# EAGLE design countdown (EAGLE 4.16)
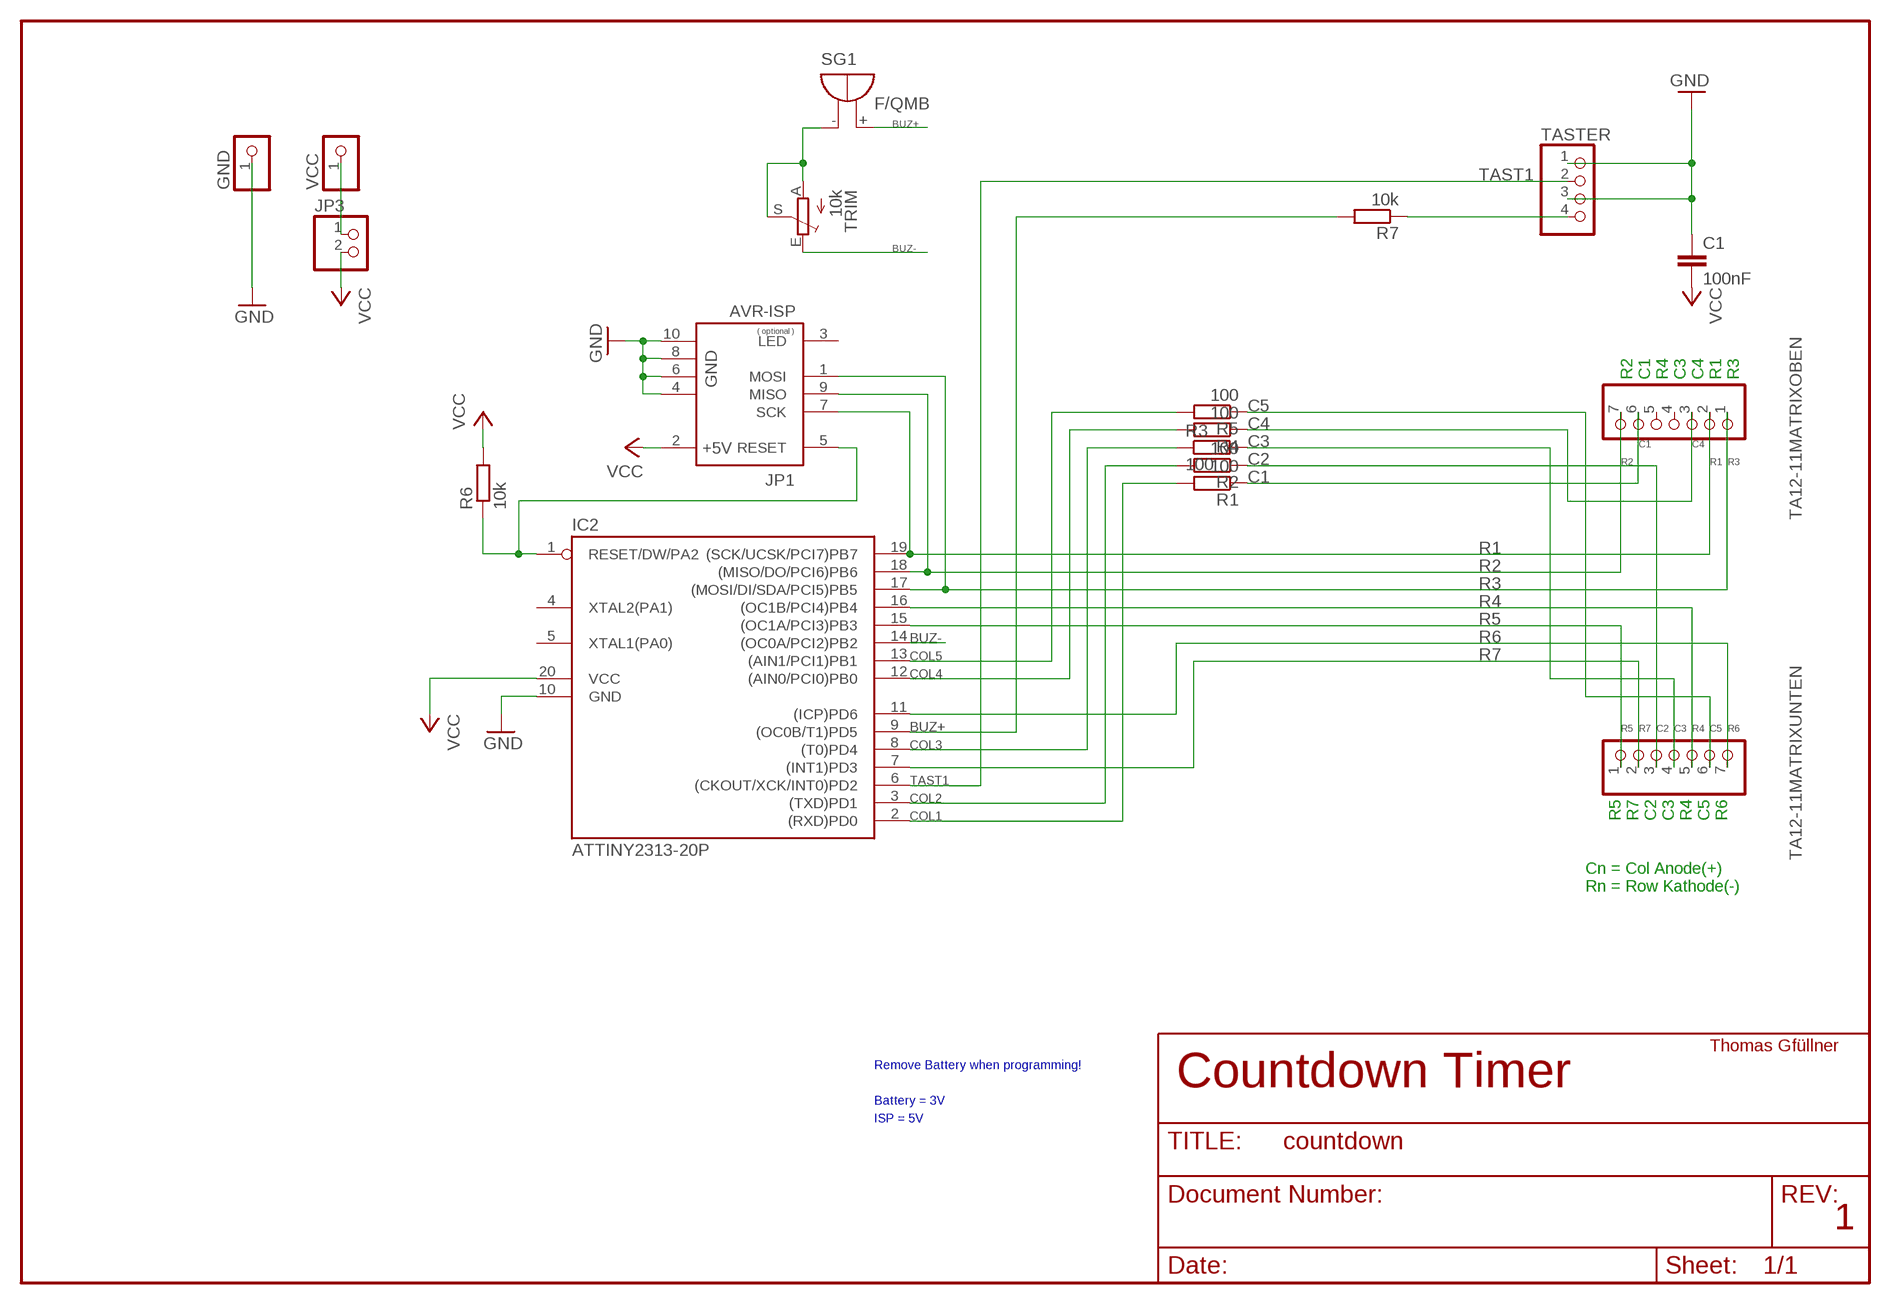
[diagram p0: schematic, sheet 1]

## Parts
C1  100nF  C-EU050-025X075  [C050-025X075]
GND  PINHD-1X1  [1X01]
IC2  ATTINY2313-20P  [DIL20]
JP1  AVR-ISP  [ML10]
JP3  PINHD-1X2  [1X02]
R1  100  R-EU_0207/12  [0207/12]
R2  100  R-EU_0207/12  [0207/12]
R3  100  R-EU_0204/7  [0204/7]
R4  100  R-EU_0207/12  [0207/12]
R5  100  R-EU_0207/12  [0207/12]
R6  10k  R-EU_0204/7  [0204/7]
R7  10k  R-EU_0207/12  [0207/12]
SG1  F/QMB  [F/QMB]
TA12-11MATRIXOBEN  PINHD-1X7  [1X07]
TA12-11MATRIXUNTEN  PINHD-1X7  [1X07]
TASTER  PINHD-1X4  [1X04]
TRIM  10k  TRIM_EU-S75H  [S75H]
VCC  PINHD-1X1  [1X01]

## Nets
BUZ+: IC2.9((OC0B/T1)PD5) R7.2 SG1.+(-)
BUZ-: IC2.14((OC0A/PCI2)PB2) TRIM.E
C1: R1.1 TA12-11MATRIXOBEN.6
C2: R2.1 TA12-11MATRIXUNTEN.3
C3: R3.2 TA12-11MATRIXUNTEN.4
C4: R4.1 TA12-11MATRIXOBEN.3
C5: R5.1 TA12-11MATRIXUNTEN.6
COL1: IC2.2((RXD)PD0) R1.2
COL2: IC2.3((TXD)PD1) R2.2
COL3: IC2.8((T0)PD4) R3.1
COL4: IC2.12((AIN0/PCI0)PB0) R4.2
COL5: IC2.13((AIN1/PCI1)PB1) R5.2
GND: C1.1 GND.1 IC2.10(GND) JP1.4(GND) JP1.6(GND) JP1.8(GND) JP1.10(GND) TASTER.1 TASTER.3
N$7: SG1.-(+) TRIM.A TRIM.S
N$9: IC2.1(RESET/DW/PA2) JP1.5(RESET) R6.1
N$10: R7.1 TASTER.4
N$27: JP3.1 VCC.1
R1: IC2.19((SCK/UCSK/PCI7)PB7) JP1.7(SCK) TA12-11MATRIXOBEN.2
R2: IC2.18((MISO/DO/PCI6)PB6) JP1.9(MISO) TA12-11MATRIXOBEN.7
R3: IC2.17((MOSI/DI/SDA/PCI5)PB5) JP1.1(MOSI) TA12-11MATRIXOBEN.1
R4: IC2.16((OC1B/PCI4)PB4) TA12-11MATRIXUNTEN.5
R5: IC2.15((OC1A/PCI3)PB3) TA12-11MATRIXUNTEN.1
R6: IC2.11((ICP)PD6) TA12-11MATRIXUNTEN.7
R7: IC2.7((INT1)PD3) TA12-11MATRIXUNTEN.2
TAST1: IC2.6((CKOUT/XCK/INT0)PD2) TASTER.2
VCC: C1.2 IC2.20(VCC) JP1.2(+5V) JP3.2 R6.2
Unconnected: IC2.4(XTAL2(PA1)) IC2.5(XTAL1(PA0)) JP1.3(LED) TA12-11MATRIXOBEN.4 TA12-11MATRIXOBEN.5

## Notes on the sheet
- R2 | C1 | R4 | C3 | C4 | R1 | R3
- R5 | R7 | C2 | C3 | R4 | C5 | R6
- Cn = Col Anode(+)
- Rn = Row Kathode(-)
- Thomas Gfüllner
- Remove Battery when programming!
- Countdown Timer
- Battery = 3V
- ISP = 5V
- 1

## Library data of the parts
C1 = rcl:C-EU: CAPACITOR, European symbol
GND VCC = pinhead:PINHD-1X1: PIN HEADER
IC2 = avr:ATTINY2313: MICROCONTROLLER 2 Kbytes FLASH 128 bytes SRAM 128 bytes EEPROM USART USI
JP1 = roboternetz-definitionen:AVR-ISP: ISP ( In System Programming ) Stecker für AVRs Über diesen Anschluß kann ein AVR mit einem Standard ISP-Kabel direkt an einen Parallelport des PC´s angeschlossen und programmiert werden. Die Belegung des ISP-Anschlusses ist zu dem weit verbreitetet STK200 Programmier Dongle kompatibel. Ein entsprechender Dongle ist über zahlreiche Händler lieferbar. Es gibt aber auch viele Selbstbauanleitungen im Internet.
JP3 = pinhead:PINHD-1X2: PIN HEADER
R1-R7 = rcl:R-EU_: RESISTOR, European symbol
SG1 = buzzer:F/QMB: BUZZER Source: Buerklin
TA12-11MATRIXOBEN TA12-11MATRIXUNTEN = pinhead:PINHD-1X7: PIN HEADER
TASTER = pinhead:PINHD-1X4: PIN HEADER
TRIM = pot:TRIM_EU-: POTENTIOMETER

## Board
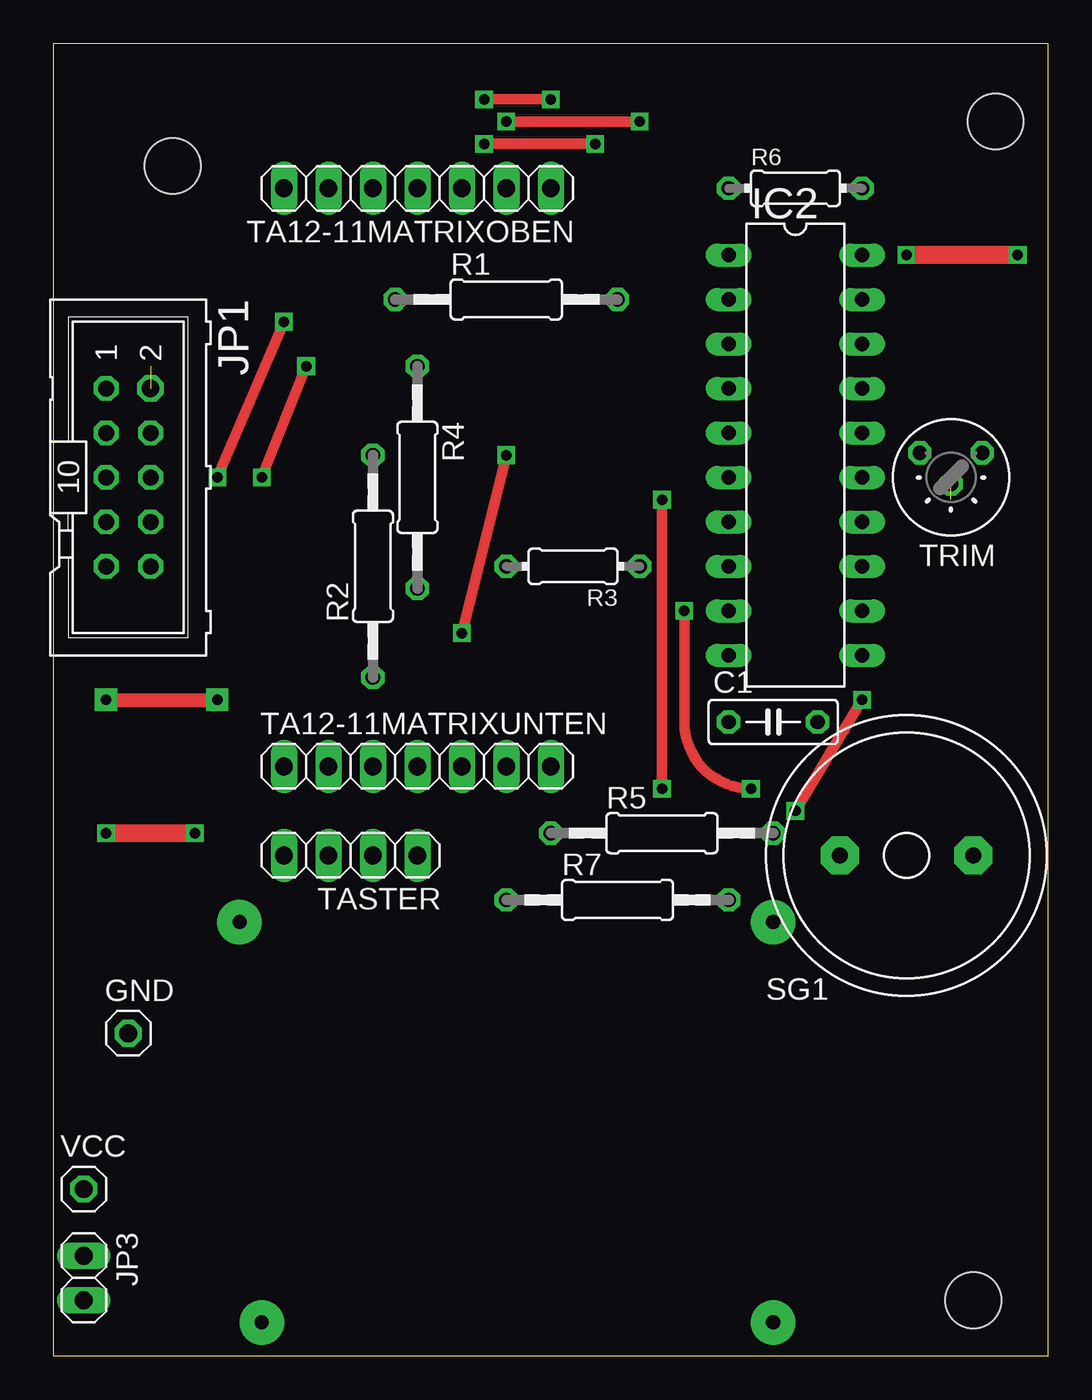
[diagram p1: board, top side]
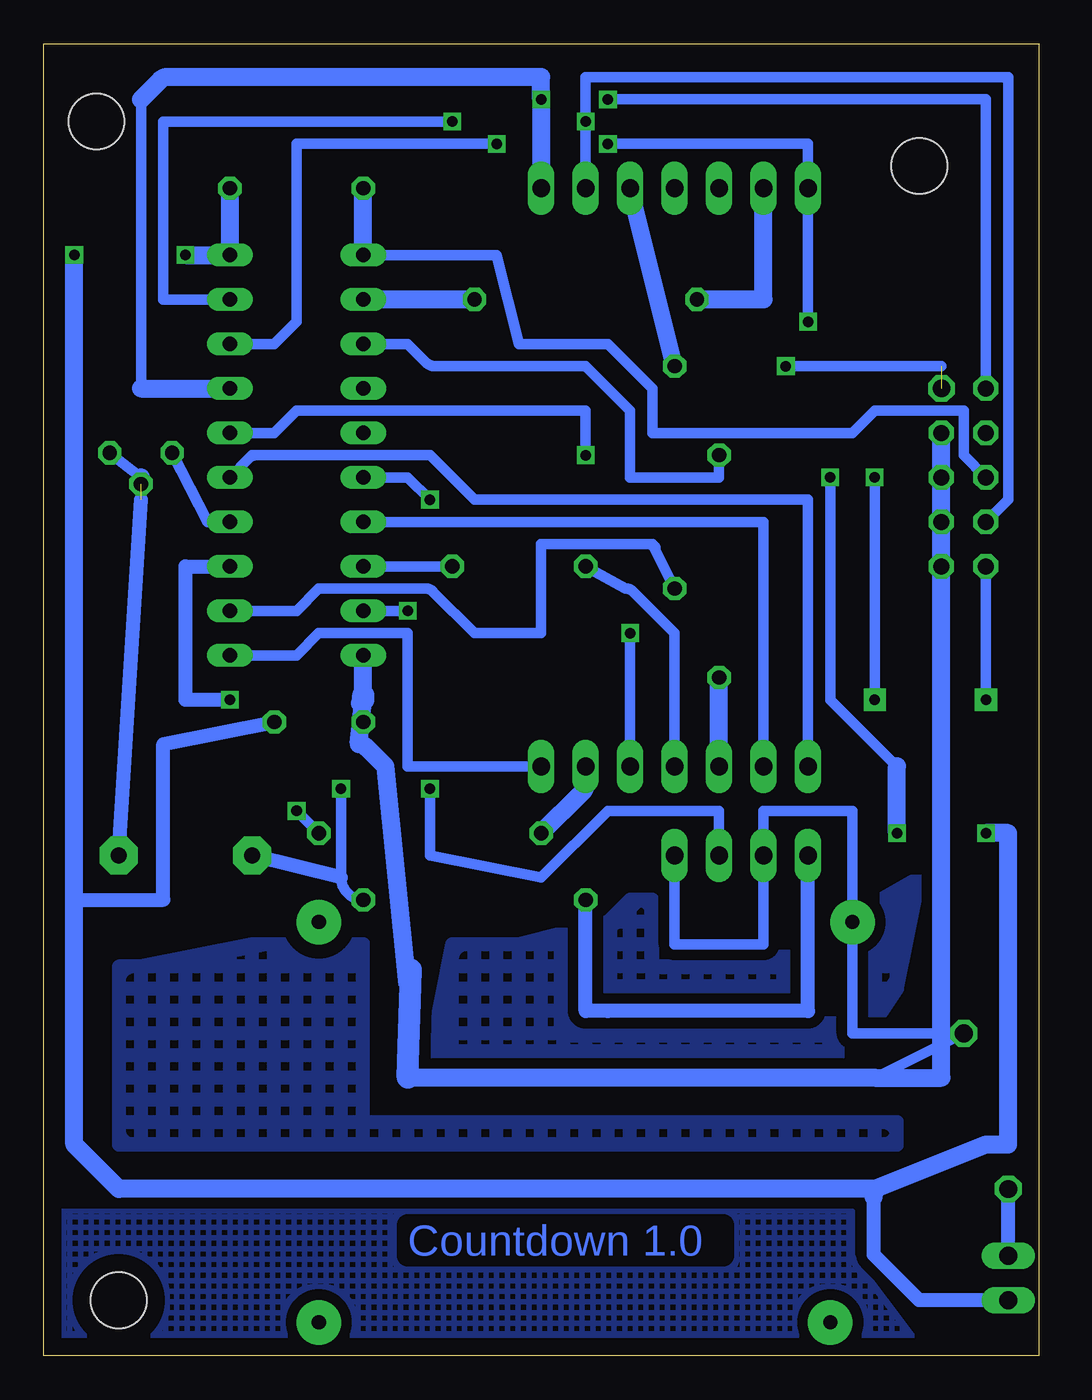
[diagram p2: board, bottom side, seen from below]

Size 56.82 x 74.92 mm. Coordinates in mm from the lower left corner, seen from the top.
Outline: 0,0 56.82,0 56.82,74.92 0,74.92 0,0
Copper layers (1*16): Top 0.035mm / dielectric 1.5mm / Bottom 0.035mm
Design rules "default": minimum track width 10mil, minimum drill 24mil, track to track 8mil, track to pad 8mil, pad to pad 8mil, via to via 8mil, smd to smd 8mil, copper to edge 40mil, drill to drill 8mil, minimum pad ring 10mil, minimum via ring 8mil, stop-mask expansion 4mil, vias tented up to drill 0mil, thermal gap 10mil
Holes 3.2 mm at 52.54,3.17 53.81,70.48 6.82,67.94

### Footprints (pad centres in the part's own frame; a part is rotated, then mirrored left to right if it is on the bottom)
C050-025X075 = drill 0.813 octagon: 1 -2.54,0; 2 2.54,0
1X01 = drill 1.016 octagon: 1 0,0
DIL20 = drill 0.813 long: 1 -11.43,-3.81; 2 -8.89,-3.81; 3 -6.35,-3.81; 4 -3.81,-3.81; 5 -1.27,-3.81; 6 1.27,-3.81; 7 3.81,-3.81; 8 6.35,-3.81; 9 8.89,-3.81; 10 11.43,-3.81; 11 11.43,3.81; 12 8.89,3.81; 13 6.35,3.81; 14 3.81,3.81; 15 1.27,3.81; 16 -1.27,3.81; 17 -3.81,3.81; 18 -6.35,3.81; 19 -8.89,3.81; 20 -11.43,3.81
ML10 = drill 0.914 pad 1.422 octagon: 1 -5.08,-1.27; 3 -2.54,-1.27; 4 -2.54,1.27 | drill 1.016 pad 1.422 octagon: 2 -5.08,1.27 | drill 0.914 octagon: 5 0,-1.27; 6 0,1.27; 7 2.54,-1.27; 8 2.54,1.27; 9 5.08,-1.27; 10 5.08,1.27
1X02 = drill 1.016 long: 1 -1.27,0; 2 1.27,0
0207/12 = drill 0.813 octagon: 1 -6.35,0; 2 6.35,0
0204/7 = drill 0.813 octagon: 1 -3.81,0; 2 3.81,0
F/QMB = drill 0.914 pad 2.159 octagon: + 3.81,0; - -3.81,0
1X07 = drill 1.016 long: 1 -7.62,0; 2 -5.08,0; 3 -2.54,0; 4 0,0; 5 2.54,0; 6 5.08,0; 7 7.62,0
1X04 = drill 1.016 long: 1 -3.81,0; 2 -1.27,0; 3 1.27,0; 4 3.81,0
S75H = drill 0.813 octagon: A -1.778,-1.397; E 1.778,-1.397; S 0,0.381

### Placement (x,y rotation side)
C1  41.11,36.19 0 top
GND  4.28,18.41 0 top
IC2  42.38,51.43 270 top
JP1  4.28,50.16 270 top
JP3  1.74,4.44 270 top
R1  25.87,60.32 0 top
R2  18.25,45.08 90 top
R3  29.68,45.08 180 top
R4  20.79,50.16 270 top
R5  34.76,29.84 0 top
R6  42.38,66.67 0 top
R7  32.22,26.03 0 top
SG1  48.73,28.57 180 top
TA12-11MATRIXOBEN  20.79,66.67 180 top
TA12-11MATRIXUNTEN  20.79,33.65 0 top
TASTER  16.98,28.57 180 top
TRIM  51.27,50.16 180 top
VCC  1.74,9.52 0 top

### Tracks (layer width: path | path; a pad name or v marks a point on that pad's centre or on a via)
BUZ+  (via drill 0.6 pad 0.3)
  Top 0.61: v36.03,42.54 36.03,36.19 arc90 v39.84,32.38
  Bottom 0.61: v36.03,42.54 IC2.9 | v39.84,32.38 39.84,27.3 arc-90 R7.2
  Bottom 0.813: 39.84,27.3 SG1.+
BUZ-
  Bottom 0.61: TRIM.E 47.46,47.62 IC2.14
C1
  Bottom 1.016: R1.1 15.71,60.32 TA12-11MATRIXOBEN.6
C2
  Bottom 1.016: TA12-11MATRIXUNTEN.3 R2.1
C3
  Bottom 0.61: TA12-11MATRIXUNTEN.4 20.79,41.27 23.14,43.62 arc-45 23.59,43.81 R3.2
C4
  Bottom 1.016: R4.1 TA12-11MATRIXOBEN.3
C5
  Bottom 1.016: R5.1 26.06,32.19 arc-45 25.87,32.64 TA12-11MATRIXUNTEN.6
COL1
  Bottom 1.016: R1.2 IC2.2
COL2
  Bottom 0.61: IC2.3 36.03,57.78 34.95,56.7 arc-45 34.5,56.51 25.87,56.51 23.33,53.97 23.33,50.16 18.25,50.16 R2.2
COL3
  Bottom 0.61: R3.1 IC2.8
COL4
  Bottom 0.61: 22.32,46.35 arc45 21.87,46.16 | 22.32,46.35 28.41,46.35 28.41,41.27 32.22,41.27 34.57,43.62 arc-45 35.02,43.81 41.11,43.81 42.38,42.54 IC2.12 | 22.32,46.35 22.06,46.35 R4.2
COL5  (via drill 0.6 pad 0.3)
  Top 0.61: v42.38,31.11 v46.19,37.46
  Bottom 0.61: R5.2 v42.38,31.11
  Bottom 0.813: v46.19,37.46 48.73,37.46 48.73,45.08 IC2.13
GND
  Bottom 0.61: 9.36,15.87 GND.1 10.63,18.41 10.63,31.11 15.71,31.11 TASTER.3 15.71,23.49 20.79,23.49 TASTER.1
  Bottom 1.016: 38.76,37.27 arc-45 38.57,37.72 IC2.10 | 35.84,22.03 arc45 36.03,21.21 37.3,33.65 38.38,34.73 arc-45 38.83,34.92 38.7,36.2 | 36.03,15.87 9.36,15.87 5.55,15.87 JP1.10 JP1.8 JP1.6 JP1.4 | 38.7,36.2 38.57,37.46 | 38.7,36.2 C1.1
  Bottom 1.27: 36.03,15.87 35.84,22.03 | 38.57,37.46 38.57,37.72
N$1  (via drill 0.6 pad 0.3)
  other vias: 23.33,41.27
N$2  (via drill 0.6 pad 0.3)
  other vias: 34.76,48.89
N$3  (via drill 0.6 pad 0.3)
  other vias: 34.76,32.38
N$4  (via drill 0.6 pad 0.3)
  other vias: 36.03,42.54
N$5  (via drill 0.6 pad 0.3)
  other vias: 39.84,32.38
N$6  (via drill 0.6 pad 0.3)
  other vias: 46.19,37.46
N$7  (1 unrouted)
  Bottom 0.61: 51.27,50.16 TRIM.A
  Bottom 0.813: SG1.- 51.27,48.89
  Bottom 1.016: TRIM.S 51.27,50.16
N$8  (via drill 0.6 pad 0.3)
  other vias: 42.38,31.11
N$9
  Bottom 0.61: IC2.1 30.95,62.86 29.68,57.78 24.6,57.78 22.06,55.24 22.06,52.7 10.63,52.7 9.36,53.97 4.28,53.97 4.28,51.43 JP1.5
  Bottom 1.016: IC2.1 R6.1
N$10
  Bottom 0.813: TASTER.4 13.17,19.68 24.6,19.68 25.87,19.68 R7.1
N$11  (via drill 0.6 pad 0.3)
  other vias: 48.73,62.86
N$12  (via drill 0.8 pad 2.54)
  other vias: 41.11,24.76
N$13  (via drill 0.6 pad 0.3)
  other vias: 9.36,50.16
N$14  (via drill 0.6 pad 0.3)
  other vias: 13.17,59.05
N$15  (via drill 0.6 pad 0.3)
  other vias: 24.6,71.75
N$16  (via drill 0.6 pad 0.3)
  other vias: 30.95,69.21
N$17  (via drill 0.6 pad 0.3)
  other vias: 24.6,69.21
N$18  (via drill 0.6 pad 0.3)
  other vias: 33.49,70.48
N$19  (via drill 0.6 pad 0.3)
  other vias: 11.9,50.16
N$20  (via drill 0.6 pad 0.3)
  other vias: 3.01,29.84
N$21  (via drill 0.8 pad 2.54)
  other vias: 41.11,1.9
N$22  (via drill 0.8 pad 2.54)
  other vias: 10.63,24.76
N$23  (via drill 0.8 pad 2.54)
  other vias: 11.9,1.9
N$24
  pour Bottom (isolate 0.813, rank 2, hatched): 8.09,13.33 38.57,13.33 38.57,23.49 44.92,23.49 51.27,22.22 52.54,22.22 52.54,12.06 8.09,12.06
N$25
  pour Bottom (isolate 0.61, hatched): 6.82,0.63 10.63,5.71 10.63,8.25 56.35,8.25 56.35,0.63
N$26
  pour Bottom (isolate 0.61, no thermals, hatched): 34.76,17.14 10.63,17.14 8.09,20.95 6.82,27.3 15.71,22.22 22.06,22.22 22.06,26.03 23.33,26.03 24.6,24.76 29.68,23.49 33.49,23.49
N$27
  Bottom 0.813: JP3.1 VCC.1
R1  (via drill 0.6 pad 0.3)
  Top 0.61: v25.87,70.48 v33.49,70.48
  Bottom 0.61: JP1.7 1.74,48.89 1.74,73.02 25.87,73.02 v25.87,70.48 TA12-11MATRIXOBEN.2 | IC2.19 50,60.32 50,70.48 v33.49,70.48
R2  (via drill 0.6 pad 0.3, 0.6 pad 1.27)
  Top 0.61: v9.36,50.16 v13.17,59.05 | v24.6,69.21 v30.95,69.21
  Top 0.813: v3.01,37.46 v9.36,37.46
  Bottom 0.61: IC2.18 43.65,57.78 42.38,59.05 42.38,69.21 v30.95,69.21 | v3.01,37.46 JP1.9 | v9.36,37.46 v9.36,50.16 | v13.17,59.05 TA12-11MATRIXOBEN.7 13.17,69.21 v24.6,69.21
R3  (via drill 0.6 pad 0.3)
  Top 0.61: v24.6,71.75 v28.41,71.75
  Bottom 0.61: 51.27,71.75 51.27,55.24 | JP1.1 3.01,71.75 v24.6,71.75
  Bottom 1.016: 51.27,55.24 IC2.17 | 51.27,71.75 50.19,72.83 arc45 49.74,73.02 28.41,73.02 v28.41,71.75 TA12-11MATRIXOBEN.1
R4  (via drill 0.6 pad 0.3)
  Top 0.61: v23.33,41.27 v25.87,51.43
  Bottom 0.61: IC2.16 43.65,52.7 42.38,53.97 25.87,53.97 v25.87,51.43 | TA12-11MATRIXUNTEN.5 v23.33,41.27
R5
  Bottom 0.61: IC2.15 45.11,51.24 arc45 44.66,51.43 | TA12-11MATRIXUNTEN.1 13.17,48.89 32.22,48.89 34.76,51.43 44.66,51.43 | 44.66,51.43 44.92,51.43
R6
  Bottom 0.61: IC2.11 42.38,40 41.11,41.27 36.03,41.27 36.03,33.65 TA12-11MATRIXUNTEN.7
R7
  Bottom 0.61: IC2.7 15.71,47.62 TA12-11MATRIXUNTEN.2
TAST1  (via drill 0.6 pad 0.3)
  Top 0.61: v34.76,32.38 v34.76,48.89
  Bottom 0.61: IC2.6 36.03,50.16 v34.76,48.89 | v34.76,32.38 34.76,28.57 28.41,27.3 24.6,31.11 18.25,31.11 TASTER.2
VCC  (via drill 0.6 pad 0.3)  (1 unrouted)
  Top 0.61: v11.9,50.16 v14.44,56.51
  Top 1.016: v55.08,62.86 v48.73,62.86 | v3.01,29.84 v8.09,29.84
  Bottom 0.61: v14.44,56.51 5.55,56.51 | v11.9,50.16 11.9,37.46 8.09,33.65
  Bottom 0.813: 55.08,26.03 50,26.03 50,34.92 C1.2 | 9.42,9.05 9.42,5.77 6.82,3.17 JP3.2
  Bottom 1.016: R6.2 IC2.20 v48.73,62.86 | v55.08,62.86 55.08,26.03 55.08,12.06 52.54,9.52 9.36,9.52 | v8.09,29.84 8.09,33.65 | 9.42,9.05 9.36,9.52 | 9.36,9.52 3.01,12.06 1.74,12.06 1.74,29.84 v3.01,29.84

### Text on the board
Bottom: Countdown 1.0